# EAGLE design placa_TC (EAGLE 6.5.0)
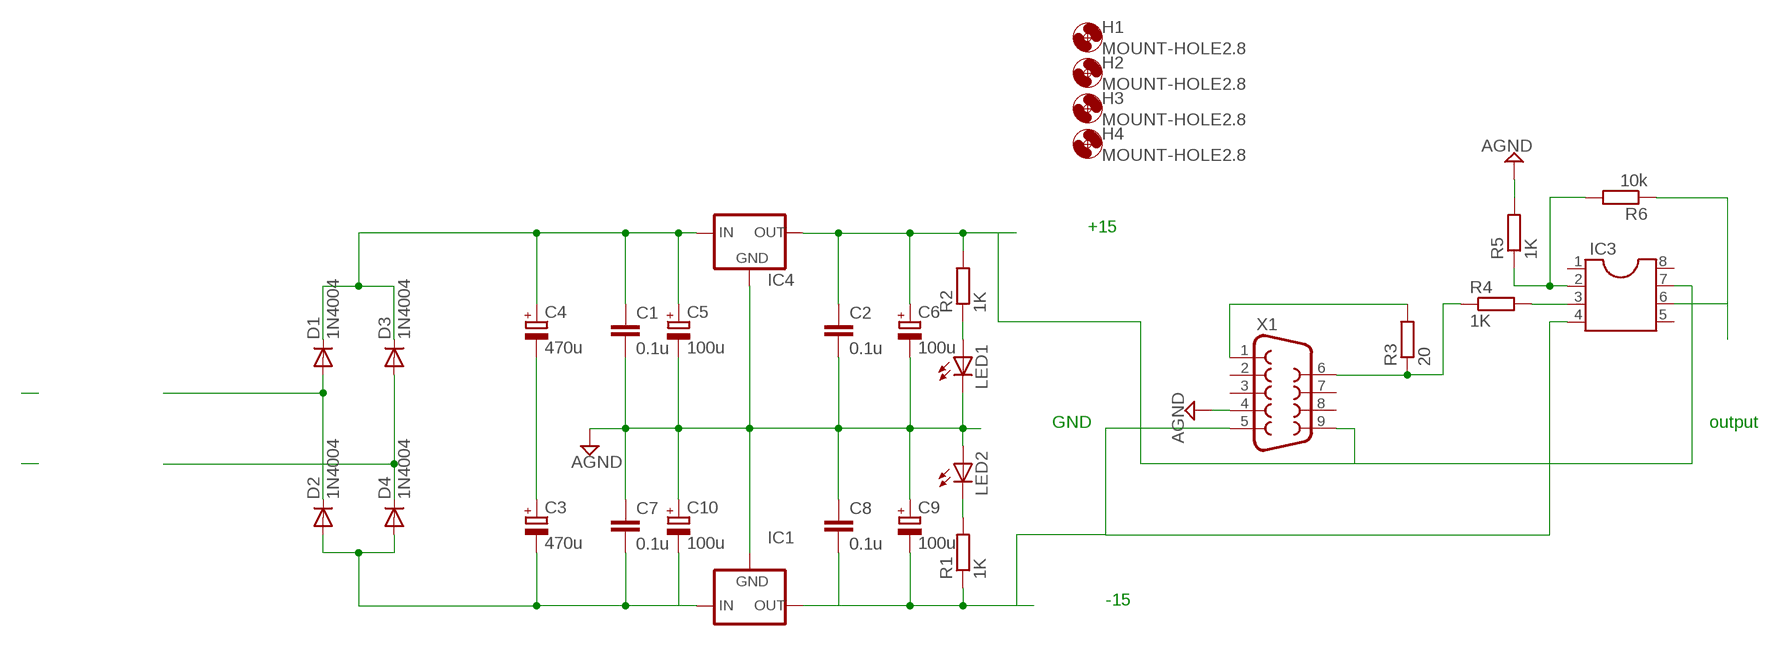
[diagram p0: schematic, sheet 1]

## Parts
C1  0.1u  C-EU025-024X044  [C025-024X044]
C2  0.1u  C-EU025-024X044  [C025-024X044]
C3  470u  CPOL-EUE5-10.5  [E5-10,5]
C4  470u  CPOL-EUE5-10.5  [E5-10,5]
C5  100u  CPOL-EUE5-10.5  [E5-10,5]
C6  100u  CPOL-EUE5-10.5  [E5-10,5]
C7  0.1u  C-EU025-024X044  [C025-024X044]
C8  0.1u  C-EU025-024X044  [C025-024X044]
C9  100u  CPOL-EUE5-10.5  [E5-10,5]
C10  100u  CPOL-EUE5-10.5  [E5-10,5]
D1  1N4004  [DO41-10]
D2  1N4004  [DO41-10]
D3  1N4004  [DO41-10]
D4  1N4004  [DO41-10]
H1  MOUNT-HOLE2.8  [2,8]
H2  MOUNT-HOLE2.8  [2,8]
H3  MOUNT-HOLE2.8  [2,8]
H4  MOUNT-HOLE2.8  [2,8]
IC1  79XXS  [79XXS]
IC3  DIL8  [DIL08]
IC4  78XXS  [78XXS]
LED1  LED3MM  [LED3MM]
LED2  LED3MM  [LED3MM]
R1  1K  R-EU_0207/10  [0207/10]
R2  1K  R-EU_0207/10  [0207/10]
R3  20  R-EU_0207/10  [0207/10]
R4  1K  R-EU_0207/10  [0207/10]
R5  1K  R-EU_0207/10  [0207/10]
R6  10k  R-EU_0207/10  [0207/10]
X1  F09HP  [F09HP]

## Nets
15V+: C1.1 C4.+ C5.+ D1.C D3.C IC4.IN
+15V: C2.1 C6.+ IC3.7 IC4.OUT R2.2 X1.9
-15V: C3.- C7.2 C10.- D2.A D4.A IC1.IN
AGND: C1.2 C2.2 C5.- C6.- C7.1 C8.1 C9.+ C10.+ IC1.GND IC4.GND LED1.K(C) LED2.A R5.2 X1.4
M15: C8.2 C9.- IC1.OUT IC3.4 R1.1 X1.5
N$3: C3.+ C4.-
N$4: D3.A D4.C
N$5: D1.A D2.C
N$6: IC3.3 R4.2
N$7: IC3.2 R5.1 R6.2
N$9: R3.1 R4.1 X1.6
N$12: LED2.K(C) R1.2
N$13: R3.2 X1.1
N$14: LED1.A R2.1
OUT: IC3.6 R6.1
Unconnected: IC3.1 IC3.5 IC3.8 X1.2 X1.3 X1.7 X1.8

## Notes on the sheet
- +15
- GND | output
- -15

## Library data of the parts
C1 C2 C7 C8 = rcl:C-EU: CAPACITOR, European symbol
C3-C6 C9 C10 = rcl:CPOL-EU: POLARIZED CAPACITOR, European symbol
D1-D4 = diode:1N4004: DIODE general purpose rectifier, 1 A
H1-H4 = holes:MOUNT-HOLE: MOUNTING HOLE with drill center marker
IC1 = v-reg:79XXS: VOLTAGE REGULATOR
IC3 = ic-package:DIL8: Dual In Line
IC4 = v-reg:78XXS: VOLTAGE REGULATOR
LED1 LED2 = led:LED: LED OSRAM: - CHIPLED LG R971, LG N971, LY N971, LG Q971, LY Q971, LO R971, LY R971 LH N974, LH R974 LS Q976, LO Q976, LY Q976 LO Q996 - Hyper CHIPLED LW Q18S LB Q993, LB Q99A, LB R99A - SideLED LS A670, LO A670, LY A670, LG A670, LP A670 LB A673, LV A673, LT A673, LW A673 LH A674 LY A675 LS A676, LA A676, LO A676, LY A676, LW A676 LS A679, LY A679, LG A679 - Hyper Micro SIDELED® LS Y876, LA Y876, LO Y876, LY Y876 LT Y87S - SmartLED LW L88C, LW L88S LB L89C, LB L89S, LG L890 LS L89K, LO L89K, LY L89K LS L896, LA L896, LO L896, LY L896 - TOPLED LS T670, LO T670, LY T670, LG T670, LP T670 LSG T670, LSP T670, LSY T670, LOP T670, LYG T670 LG T671, LOG T671, LSG T671 LB T673, LV T673, LT T673, LW T673 LH T674 LS T676, LA T676, LO T676, LY T676, LB T676, LH T676, LSB T676, LW T676 LB T67C, LV T67C, LT T67C, LS T67K, LO T67K, LY T67K, LW E67C LS E67B, LA E67B, LO E67B, LY E67B, LB E67C, LV E67C, LT E67C LW T67C LS T679, LY T679, LG T679 LS T770, LO T770, LY T770, LG T770, LP T770 LB T773, LV T773, LT T773, LW T773 LH T774 LS E675, LA E675, LY E675, LS T675 LS T776, LA T776, LO T776, LY T776, LB T776 LHGB T686 LT T68C, LB T68C - Hyper Mini TOPLED® LB M676 - Mini TOPLED Santana® LG M470 LS M47K, LO M47K, LY M47K Source: http://www.osram.convergy.de - LUMILED® LXK2-PW12-R00, LXK2-PW12-S00, LXK2-PW14-U00, LXK2-PW14-V00 LXK2-PM12-R00, LXK2-PM12-S00, LXK2-PM14-U00 LXK2-PE12-Q00, LXK2-PE12-R00, LXK2-PE12-S00, LXK2-PE14-T00, LXK2-PE14-U00 LXK2-PB12-K00, LXK2-PB12-L00, LXK2-PB12-M00, LXK2-PB14-N00, LXK2-PB14-P00, LXK2-PB14-Q00 LXK2-PR12-L00, LXK2-PR12-M00, LXK2-PR14-Q00, LXK2-PR14-R00 LXK2-PD12-Q00, LXK2-PD12-R00, LXK2-PD12-S00 LXK2-PH12-R00, LXK2-PH12-S00 LXK2-PL12-P00, LXK2-PL12-Q00, LXK2-PL12-R00 Source: www.luxeon.com
R1-R6 = rcl:R-EU_: RESISTOR, European symbol
X1 = con-subd:F09: SUB-D

## Board
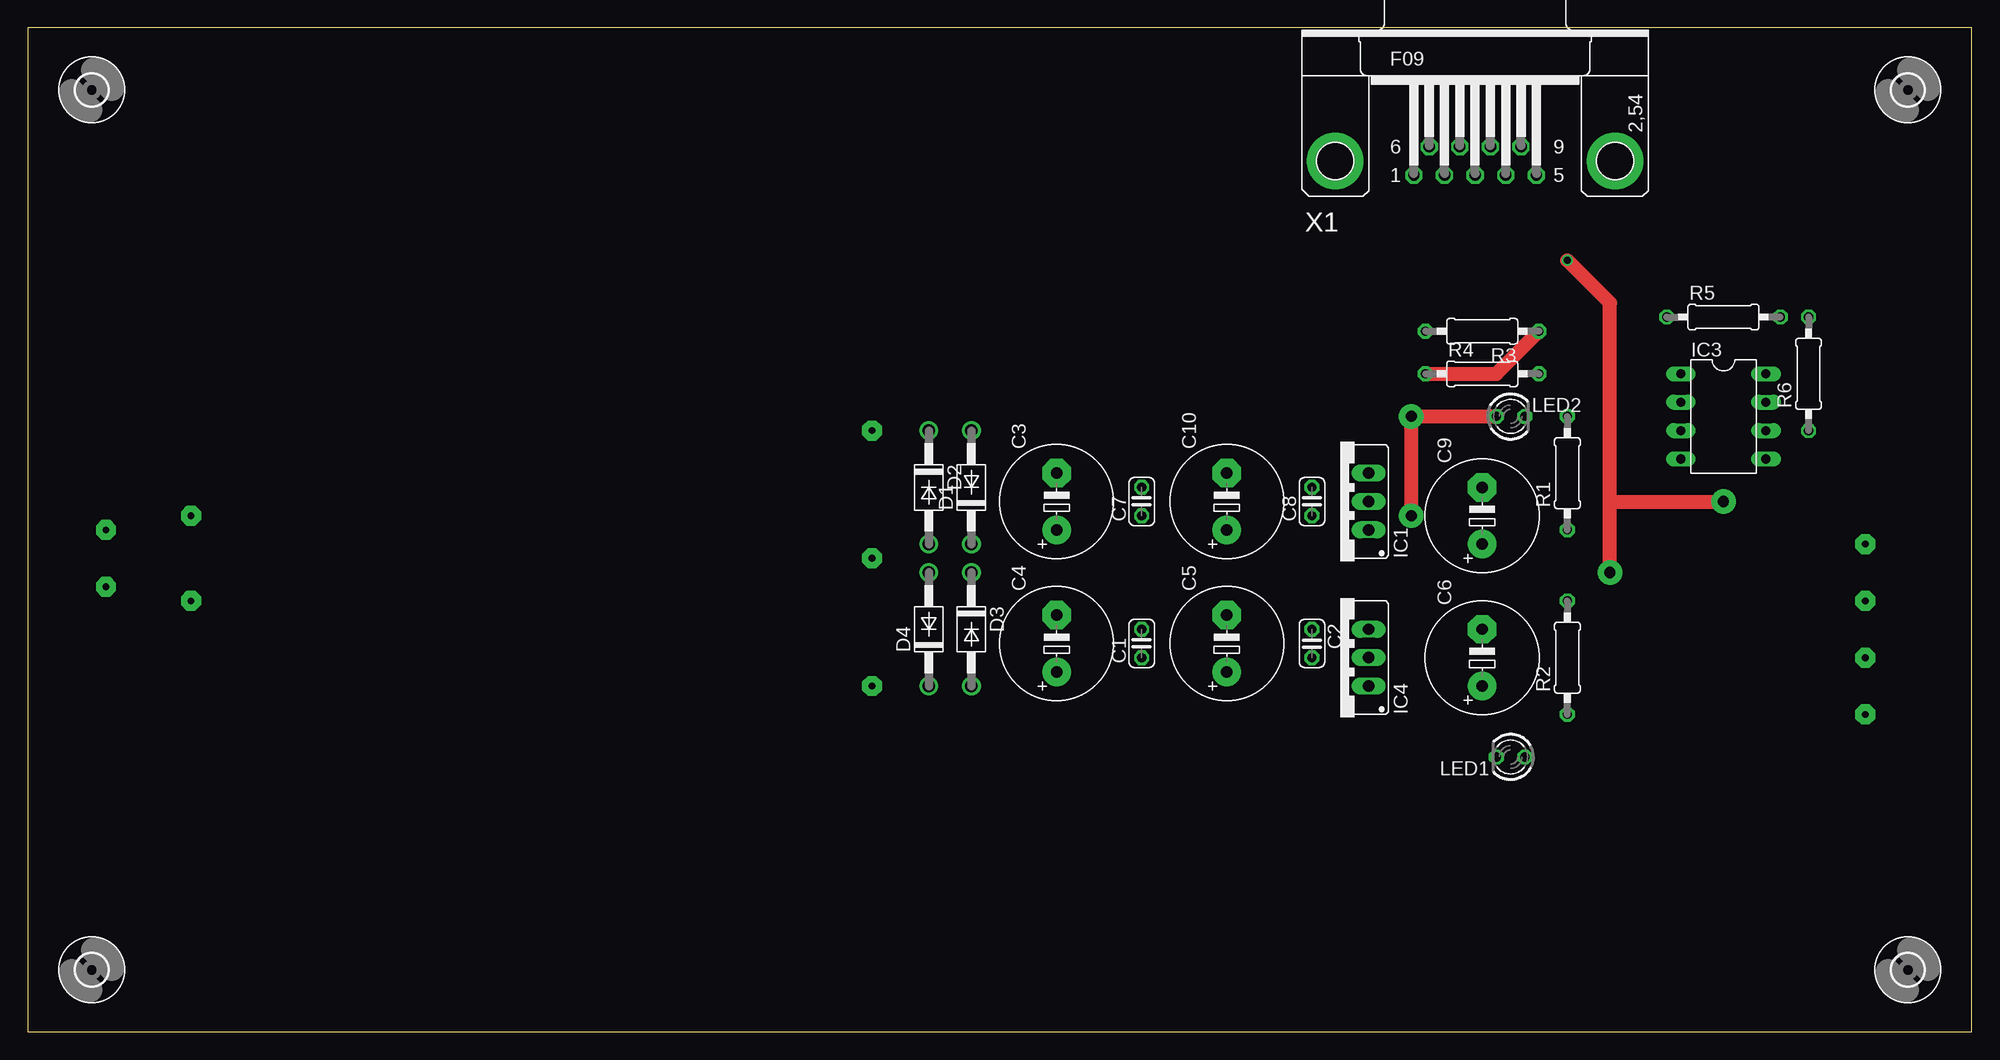
[diagram p1: board, top side]
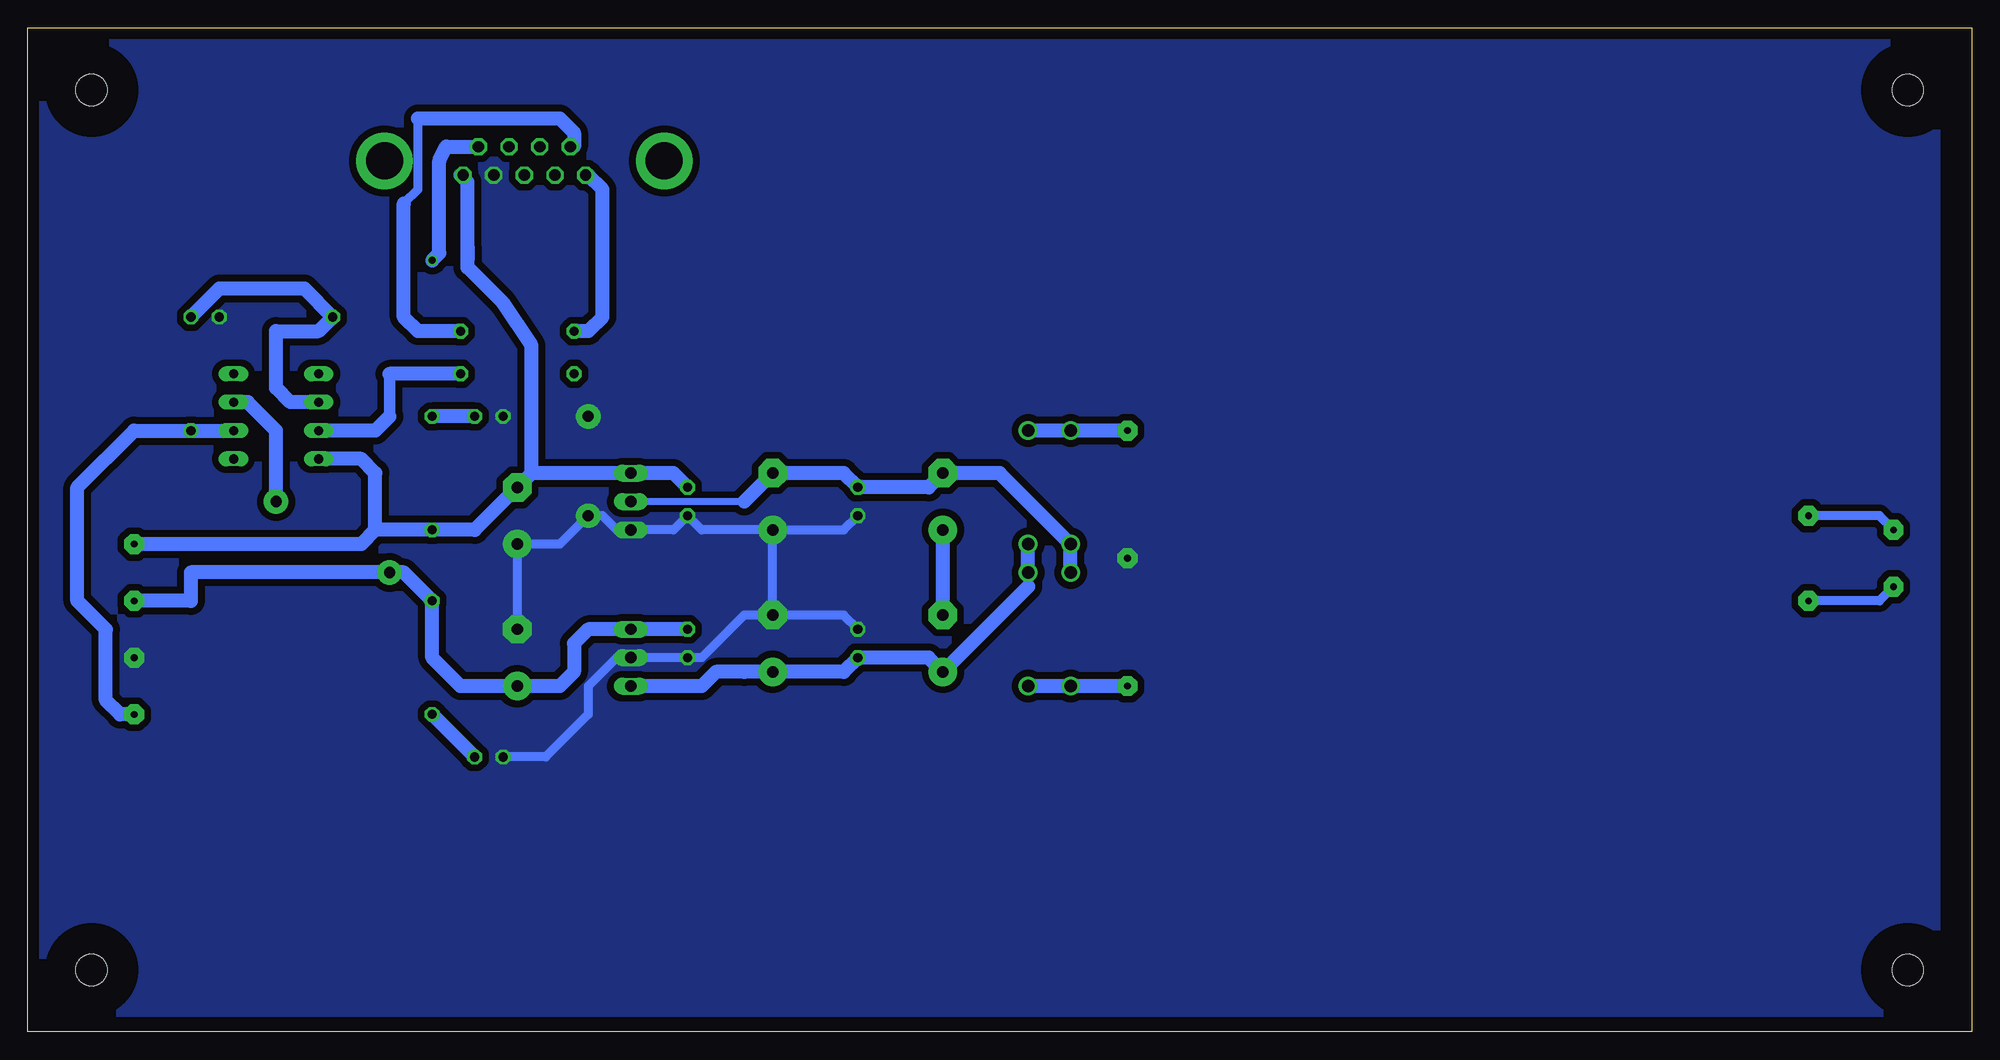
[diagram p2: board, bottom side, seen from below]

Size 173.97 x 89.84 mm. Coordinates in mm from the lower left corner, seen from the top.
Outline: 0,0 173.97,0 173.97,89.84 0,89.84 0,0
Copper layers (1*16): Top 0.035mm / dielectric 1.5mm / Bottom 0.035mm
Design rules "default": minimum track width 20mil, minimum drill 24mil, track to track 8mil, track to pad 8mil, pad to pad 8mil, via to via 8mil, smd to smd 8mil, copper to edge 40mil, drill to drill 8mil, minimum pad ring 10mil, minimum via ring 8mil, stop-mask expansion 4mil, vias tented up to drill 0mil, thermal gap 10mil

### Footprints (pad centres in the part's own frame; a part is rotated, then mirrored left to right if it is on the bottom)
C025-024X044 = drill 0.813 octagon: 1 -1.27,0; 2 1.27,0
E5-10,5 = drill 1.016 pad 2.54: + -2.54,0 | drill 1.016 pad 2.54 octagon: - 2.54,0
DO41-10 = drill 1.118: A 5.08,0; C -5.08,0
2,8 = hole 2.8: 0,0
79XXS = drill 1.016 long: GND -2.54,-2.54; IN 0,-2.54; OUT 2.54,-2.54
DIL08 = drill 0.813 long: 1 -3.81,-3.81; 2 -1.27,-3.81; 3 1.27,-3.81; 4 3.81,-3.81; 5 3.81,3.81; 6 1.27,3.81; 7 -1.27,3.81; 8 -3.81,3.81
78XXS = drill 1.016 long: GND 0,-2.54; IN -2.54,-2.54; OUT 2.54,-2.54
LED3MM = drill 0.813 octagon: A -1.27,0; K 1.27,0
0207/10 = drill 0.813 octagon: 1 -5.08,0; 2 5.08,0
F09HP = drill 1.016 octagon: 1 -5.486,-1.27; 2 -2.743,-1.27; 3 0,-1.27; 4 2.743,-1.27; 5 5.486,-1.27; 6 -4.115,1.27; 7 -1.372,1.27; 8 1.372,1.27; 9 4.115,1.27 | drill 3.302 pad 5.08: G1 -12.522,0; G2 12.522,0

### Placement (x,y rotation side)
C1  99.69,34.76 90 top
C2  114.93,34.76 270 top
C3  92.07,47.46 90 top
C4  92.07,34.76 90 top
C5  107.31,34.76 90 top
C6  130.17,33.49 90 top
C7  99.69,47.46 90 top
C8  114.93,47.46 90 top
C9  130.17,46.19 90 top
C10  107.31,47.46 90 top
D1  84.45,48.73 90 top
D2  80.64,48.73 270 top
D3  84.45,36.03 270 top
D4  80.64,36.03 90 top
H1  5.71,84.29 0 top
H2  5.71,5.55 0 top
H3  168.27,84.29 0 top
H4  168.27,5.55 0 top
IC1  117.47,47.46 90 top
IC3  151.76,55.08 270 top
IC4  117.47,33.49 90 top
LED1  132.71,24.6 180 top
LED2  132.71,55.08 0 top
R1  137.79,50 90 top
R2  137.79,33.49 90 top
R3  130.17,62.7 180 top
R4  130.17,58.89 0 top
R5  151.76,63.97 0 top
R6  159.38,58.89 90 top
X1  129.53,77.94 0 top

### Tracks (layer width: path | path; a pad name or v marks a point on that pad's centre or on a via)
15V+
  Bottom 0.813: 84.45,39.84 D3.C
  Bottom 1.27: D3.C D1.C | 84.45,39.84 C4.+ 93.34,33.49 C1.1 100.96,32.22 C5.+ 109.85,32.22 112.39,32.22 113.66,30.95 IC4.IN
+15V  (via drill 0.6, 0.6 pad 1.78, 1 pad 2.18)
  Top 1.27: v141.6,41.11 141.6,47.46 | 141.6,47.46 v151.76,47.46 | 141.6,47.46 141.6,65.24 v137.79,69.05
  Bottom 1.27: X1.9 136.52,79.21 137.16,77.94 137.16,69.69 v137.79,69.05 | IC3.7 154.3,56.35 151.76,53.81 v151.76,47.46 | C2.1 IC4.OUT 123.82,36.03 125.09,34.76 125.09,32.22 126.36,30.95 C6.+ 135.25,30.95 137.79,33.49 R2.2 140.33,41.11 v141.6,41.11 159.38,41.11 159.38,38.57 v164.46,38.57
-15V
  Bottom 0.61: 109.85,47.46 IC1.IN
  Bottom 1.27: D4.A D2.A 86.99,50 C3.- 93.34,48.73 C7.2 100.96,50 C10.- 109.85,47.46
AGND  (via drill 0.6 pad 1.78, 1 pad 2.18)
  Top 1.27: LED2.A v123.82,55.08 v123.82,46.19
  Bottom 0.813: C7.1 100.96,44.92 C10.+ | C1.2 100.96,37.3 C5.- | C5.- C10.+ | C10.+ 113.66,44.92 C8.1 116.2,44.92 IC1.GND 121.28,44.92 122.55,46.19 v123.82,46.19 126.36,43.65 C9.+ C6.- | C5.- 109.85,37.3 113.66,33.49 C2.2 IC4.GND 121.28,33.49 123.82,30.95 123.82,28.41 127.63,24.6 LED1.K
  other vias: 164.46,33.49 75.56,42.38
  pour Bottom (isolate 0.61, no thermals): 3.17,6.82 3.17,86.83 5.71,89.37 170.81,89.37 173.35,86.83 173.35,5.55 168.27,1.74 6.98,1.74
M15  (via drill 0.6 pad 1.78)
  Bottom 1.27: C8.2 116.2,50 IC1.OUT 128.9,50 | 142.87,44.92 R1.1 133.98,44.92 C9.- 128.9,50 | 142.87,44.92 144.14,43.65 v164.46,43.65 | 142.87,44.92 142.87,50 144.14,51.27 IC3.4 | 128.9,50 128.9,61.43 131.44,65.24 133.98,67.78 134.62,68.42 134.62,70.32 | X1.5 135.25,76.67 134.62,76.03 134.62,70.32 | 134.62,70.32 134.62,69.05
N$3
  Bottom 1.27: C4.- C3.+
N$4  (via drill 0.6 pad 1.78)
  Bottom 1.27: D3.A D4.C v75.56,30.95
N$5  (via drill 0.6 pad 1.78)
  Bottom 1.27: D1.A D2.C v75.56,53.81
N$6
  Bottom 1.016: 141.6,58.89 141.6,55.08
  Bottom 1.27: IC3.3 142.87,53.81 141.6,55.08 | R4.2 141.6,58.89
N$7
  Bottom 1.27: R6.2 156.84,66.51 149.22,66.51 R5.1 147.95,62.7 151.76,62.7 151.76,57.62 150.49,56.35 IC3.2
N$9
  Top 1.27: R4.1 131.44,58.89 R3.1
  Bottom 0.813: 140.33,74.13 139.06,75.4 139.06,81.75
  Bottom 1.27: 139.06,81.75 126.36,81.75 125.09,80.48 125.09,79.21 X1.6 | 140.33,74.13 140.33,63.97 139.06,62.7 R3.1
N$11  (via drill 0.6 pad 1.78)
  Bottom 0.813: v14.6,46.19 8.25,46.19 v6.98,44.92
N$12
  Bottom 1.27: LED2.K R1.2
N$13
  Bottom 1.27: R3.2 123.82,62.7 122.55,63.97 122.55,75.4 123.82,76.67 X1.1
N$14
  Bottom 1.27: LED1.A R2.1
N$16  (via drill 0.6 pad 1.78)
  Bottom 0.813: v14.6,38.57 8.25,38.57 v6.98,39.84
OUT  (via drill 0.6 pad 1.78)
  Bottom 1.27: IC3.6 R6.1 164.46,53.81 169.54,48.73 169.54,38.57 167,36.03 167,29.68 165.73,28.41 v164.46,28.41